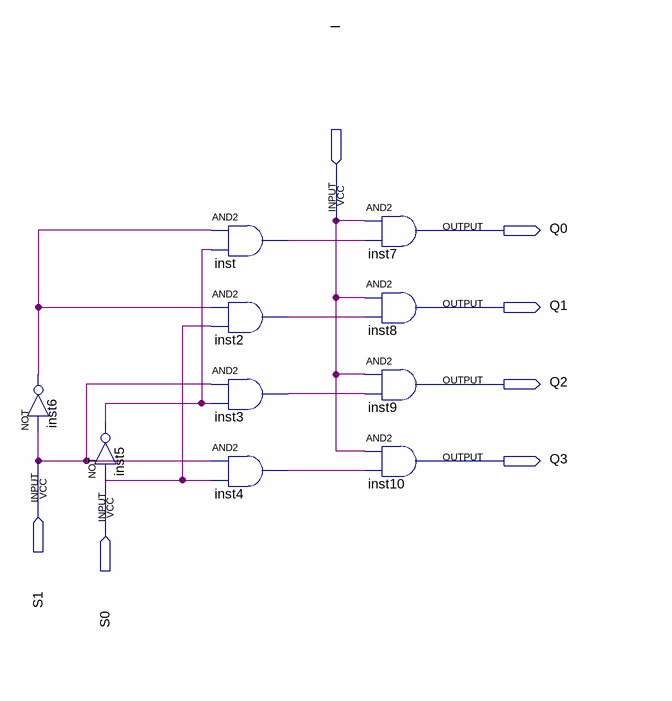
[diagram p0: schematic sheet]
// Quartus schematic s1113341_lab02_4.bdf as structural Verilog: 10 symbols, 7 pins
module s1113341_lab02_4 (
  input  I,
  input  S1,
  input  S0,
  output Q0,
  output Q1,
  output Q2,
  output Q3
);

  wire inst2_out, inst3_out, inst4_out, inst5_out, inst6_out, inst_out;

  not inst6 (inst6_out, S1);
  not inst5 (inst5_out, S0);
  and inst (inst_out, inst6_out, inst5_out);
  and inst2 (inst2_out, inst6_out, S0);
  and inst3 (inst3_out, S1, inst5_out);
  and inst4 (inst4_out, S1, S0);
  and inst7 (Q0, I, inst_out);
  and inst8 (Q1, I, inst2_out);
  and inst9 (Q2, I, inst3_out);
  and inst10 (Q3, I, inst4_out);
endmodule
